# Altium project HV_offset_board.PrjPcb
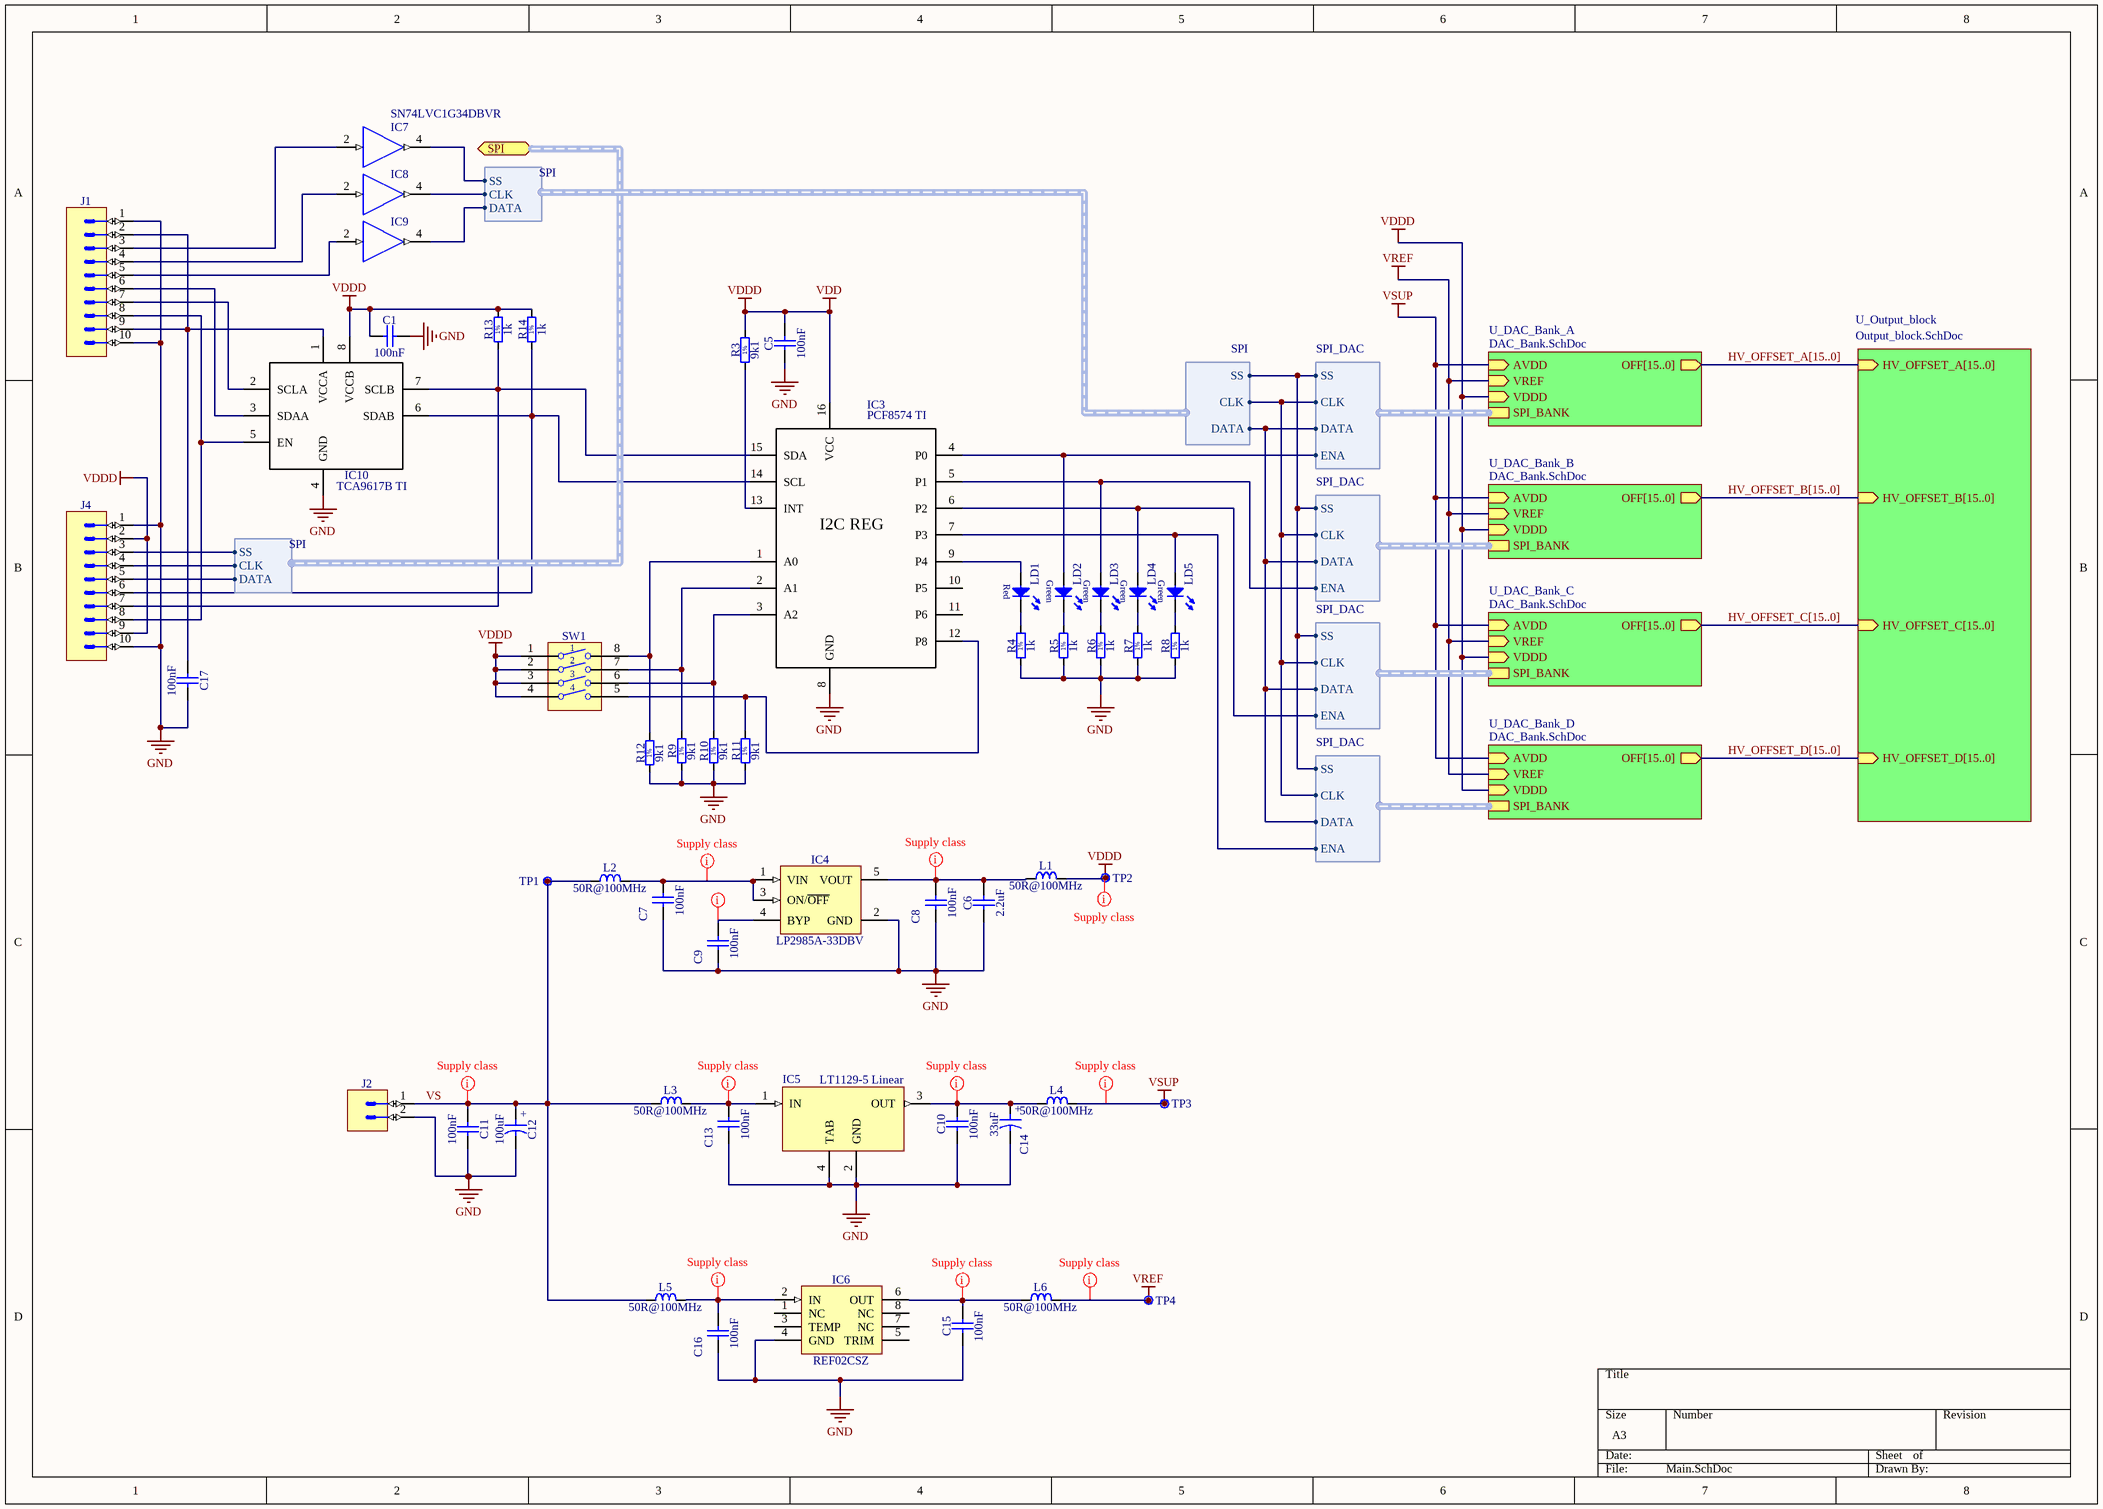
[diagram p0: Main.SchDoc]
4 sheets, 166 parts. Net scope: hierarchical (ports join the sheet entries above them; power ports are global).
Board file: PCB.PcbDoc
Sheets:
  Main.SchDoc
    U_DAC_Bank_A = DAC_Bank.SchDoc
      U_DAC = DAC.SchDoc
      U_DAC = DAC.SchDoc
      U_DAC = DAC.SchDoc
      U_DAC = DAC.SchDoc
    U_DAC_Bank_B = DAC_Bank.SchDoc
      U_DAC = DAC.SchDoc
      U_DAC = DAC.SchDoc
      U_DAC = DAC.SchDoc
      U_DAC = DAC.SchDoc
    U_DAC_Bank_C = DAC_Bank.SchDoc
      U_DAC = DAC.SchDoc
      U_DAC = DAC.SchDoc
      U_DAC = DAC.SchDoc
      U_DAC = DAC.SchDoc
    U_DAC_Bank_D = DAC_Bank.SchDoc
      U_DAC = DAC.SchDoc
      U_DAC = DAC.SchDoc
      U_DAC = DAC.SchDoc
      U_DAC = DAC.SchDoc
    U_Output_block = Output_block.SchDoc

## Sheet Main.SchDoc
size A3

### Parts
C1  100nF  [CAPC2012X135N]
C5  100nF  [CAPC2012X135N]
C6  2.2uF  [CAPC2012X135N]
C7  100nF  [CAPC2012X135N]
C8  100nF  [CAPC2012X135N]
C9  100nF  [CAPC2012X135N]
C10  100nF  [CAPC2012X135N]
C11  100nF  [CAPC2012X135N]
C12  100uF  [CAPAE660X540N]
C13  100nF  [CAPC2012X135N]
C14  33uF  [CAPAE660X540N]
C15  100nF  [CAPC2012X135N]
C16  100nF  [CAPC2012X135N]
C17  100nF  [CAPC2012X135N]
IC3  PCF8574 TI  [SOIC127P1030X265-16N]
IC4  LP2985A-33DBV  [SOT95P280X145-5N]
IC5  LT1129-5 Linear  [SOT230P700X175-4N]
IC6  REF02CSZ  [SOIC127P600X175-8N]
IC7  SN74LVC1G34DBVR  [SOT95P280X145-5N]
IC8  SN74LVC1G34DBVR  [SOT95P280X145-5N]  (value not drawn)
IC9  SN74LVC1G34DBVR  [SOT95P280X145-5N]  (value not drawn)
IC10  TCA9617B TI  [TSOP65P490X110-8N]
J1  Header 10  [3M_N2510-5002RB]  (value not drawn)
J2  (no value)  [CAMDEN_CTB9350/2A]
J4  Header 10  [3M_N2510-5002RB]  (value not drawn)
L1  50R@100MHz  [IND_MURATA_BLM31PG]
L2  50R@100MHz  [IND_MURATA_BLM31PG]
L3  50R@100MHz  [IND_MURATA_BLM31PG]
L4  50R@100MHz  [IND_MURATA_BLM31PG]
L5  50R@100MHz  [IND_MURATA_BLM31PG]
L6  50R@100MHz  [IND_MURATA_BLM31PG]
LD1  Super Red  [LED_OSRAM_LSR976]  (value not drawn)
LD2  Green  [LED_OSRAM_LGR971]  (value not drawn)
LD3  Green  [LED_OSRAM_LGR971]  (value not drawn)
LD4  Green  [LED_OSRAM_LGR971]  (value not drawn)
LD5  Green  [LED_OSRAM_LGR971]  (value not drawn)
R3  9k1  [RESC2012X60N]
R4  1k  [RESC2012X60N]
R5  1k  [RESC2012X60N]
R6  1k  [RESC2012X60N]
R7  1k  [RESC2012X60N]
R8  1k  [RESC2012X60N]
R9  9k1  [RESC2012X60N]
R10  9k1  [RESC2012X60N]
R11  9k1  [RESC2012X60N]
R12  9k1  [RESC2012X60N]
R13  1k  [RESC2012X60N]
R14  1k  [RESC2012X60N]
SW1  Switch  [SW_OMRON_A6S-4102-H]  (value not drawn)
TP1  Test Point  [VERO_20-2136]  (value not drawn)
TP2  Test Point  [VERO_20-2136]  (value not drawn)
TP3  Test Point  [VERO_20-2136]  (value not drawn)
TP4  Test Point  [VERO_20-2136]  (value not drawn)

### Sub-sheets
U_DAC_Bank_A = DAC_Bank.SchDoc: AVDD (in), VREF (in), VDDD (in), SPI_BANK (harness SPI_DAC), OFF[15..0] (out)
U_DAC_Bank_B = DAC_Bank.SchDoc: AVDD (in), VREF (in), VDDD (in), SPI_BANK (harness SPI_DAC), OFF[15..0] (out)
U_DAC_Bank_C = DAC_Bank.SchDoc: AVDD (in), VREF (in), VDDD (in), SPI_BANK (harness SPI_DAC), OFF[15..0] (out)
U_DAC_Bank_D = DAC_Bank.SchDoc: AVDD (in), VREF (in), VDDD (in), SPI_BANK (harness SPI_DAC), OFF[15..0] (out)
U_Output_block = Output_block.SchDoc: HV_OFFSET_A[15..0] (in), HV_OFFSET_D[15..0] (in), HV_OFFSET_C[15..0] (in), HV_OFFSET_B[15..0] (in)

### Ports
SPI (bidir, harness SPI)

### Harnesses
SPI_DAC: DATA, CLK, SS, ENA
SPI: DATA, CLK, SS

### Nets
GND: C1.2 C5.1 C6.1 C7.1 C8.1 C9.1 C10.1 C11.2 C12.2 C13.1 C14.2 C15.1 C16.1 C17.2 IC3.8(GND) IC4.2(GND) IC5.2(GND) IC5.4(TAB) IC6.4(GND) IC7.3(GND) IC8.3(GND) IC9.3(GND) IC10.4(GND) J1.1 J1.10 J2.2 J4.1 J4.10 R4.1 R5.1 R6.1 R7.1 R8.1 R9.1 R10.1 R11.1 R12.1
VDDD: C1.1 C5.2 IC3.16(VCC) IC7.5(VCC) IC8.5(VCC) IC9.5(VCC) IC10.8(VCCB) J4.2 J4.9 L1.2 R3.2 R13.2 R14.2 SW1.1 SW1.2 SW1.3 SW1.4 TP2.1 ; sheet U_DAC_Bank_A/VDDD, sheet U_DAC_Bank_B/VDDD, sheet U_DAC_Bank_C/VDDD, sheet U_DAC_Bank_D/VDDD  [also labelled VDD]
VREF: L6.2 TP4.1 ; sheet U_DAC_Bank_A/VREF, sheet U_DAC_Bank_B/VREF, sheet U_DAC_Bank_C/VREF, sheet U_DAC_Bank_D/VREF
VSUP: L4.2 TP3.1 ; sheet U_DAC_Bank_A/AVDD, sheet U_DAC_Bank_B/AVDD, sheet U_DAC_Bank_C/AVDD, sheet U_DAC_Bank_D/AVDD
VS: C11.1 C12.1 J2.1 L2.1 L3.1 L5.1 TP1.1
NetC6_2: C6.2 C8.2 IC4.5(VOUT) L1.1
NetC7_2: C7.2 IC4.1(VIN) IC4.3(ON/~{OFF}) L2.2
NetC9_2: C9.2 IC4.4(BYP)
NetC10_2: C10.2 C14.1 IC5.3(OUT) L4.1
NetC13_2: C13.2 IC5.1(IN) L3.2
NetC15_2: C15.2 IC6.6(OUT) L6.1
NetC16_2: C16.2 IC6.2(IN) L5.2
NetC17_1: C17.1 IC10.1(VCCA) J1.2 J1.9
NetIC2_U_DAC_Bank_A_U_DAC#1_9: IC7.4(OUT) J4.3 ; sheet U_DAC_Bank_A/SPI_BANK.SS, port SPI.SS, sheet U_DAC_Bank_B/SPI_BANK.SS, sheet U_DAC_Bank_C/SPI_BANK.SS, sheet U_DAC_Bank_D/SPI_BANK.SS
NetIC2_U_DAC_Bank_A_U_DAC#1_10: IC8.4(OUT) J4.4 ; sheet U_DAC_Bank_A/SPI_BANK.CLK, port SPI.CLK, sheet U_DAC_Bank_B/SPI_BANK.CLK, sheet U_DAC_Bank_C/SPI_BANK.CLK, sheet U_DAC_Bank_D/SPI_BANK.CLK
NetIC2_U_DAC_Bank_A_U_DAC#1_11: IC9.4(OUT) J4.5 ; sheet U_DAC_Bank_A/SPI_BANK.DATA, port SPI.DATA, sheet U_DAC_Bank_B/SPI_BANK.DATA, sheet U_DAC_Bank_C/SPI_BANK.DATA, sheet U_DAC_Bank_D/SPI_BANK.DATA
NetIC2_U_DAC_Bank_A_U_DAC#1_15: IC3.4(P0) LD2.2(A) ; sheet U_DAC_Bank_A/SPI_BANK.ENA
NetIC2_U_DAC_Bank_B_U_DAC#1_15: IC3.5(P1) LD3.2(A) ; sheet U_DAC_Bank_B/SPI_BANK.ENA
NetIC2_U_DAC_Bank_C_U_DAC#1_15: IC3.6(P2) LD4.2(A) ; sheet U_DAC_Bank_C/SPI_BANK.ENA
NetIC2_U_DAC_Bank_D_U_DAC#1_15: IC3.7(P3) LD5.2(A) ; sheet U_DAC_Bank_D/SPI_BANK.ENA
NetIC3_1: IC3.1(A0) R12.2 SW1.8
NetIC3_2: IC3.2(A1) R9.2 SW1.7
NetIC3_3: IC3.3(A2) R10.2 SW1.6
NetIC3_9: IC3.9(P4) LD1.2(A)
NetIC3_12: IC3.12(P8) R11.2 SW1.5
NetIC3_13: IC3.13(INT) R3.1
NetIC3_14: IC3.14(SCL) IC10.6(SDAB) J4.6 R14.1
NetIC3_15: IC3.15(SDA) IC10.7(SCLB) J4.7 R13.1
NetIC7_2: IC7.2(IN) J1.3
NetIC8_2: IC8.2(IN) J1.4
NetIC9_2: IC9.2(IN) J1.5
NetIC10_2: IC10.2(SCLA) J1.7
NetIC10_3: IC10.3(SDAA) J1.6
NetIC10_5: IC10.5(EN) J1.8 J4.8
NetLD1_1: LD1.1(C) R4.2
NetLD2_1: LD2.1(C) R5.2
NetLD3_1: LD3.1(C) R6.2
NetLD4_1: LD4.1(C) R7.2
NetLD5_1: LD5.1(C) R8.2

Not connected (* = marked no-connect by the designer): IC3 10(P5) 11(P6); IC6 1(NC) 3(TEMP) 5(TRIM) 7(NC) 8(NC)

### Buses and harness runs
bus HV_OFFSET_A[15..0] = sheet U_DAC_Bank_A/OFF[15..0] = sheet U_Output_block/HV_OFFSET_A[15..0]
bus HV_OFFSET_B[15..0] = sheet U_DAC_Bank_B/OFF[15..0] = sheet U_Output_block/HV_OFFSET_B[15..0]
bus HV_OFFSET_C[15..0] = sheet U_DAC_Bank_C/OFF[15..0] = sheet U_Output_block/HV_OFFSET_C[15..0]
bus HV_OFFSET_D[15..0] = sheet U_DAC_Bank_D/OFF[15..0] = sheet U_Output_block/HV_OFFSET_D[15..0]

### Layout directives
net class Supply: NetC6_2, NetC7_2, NetC9_2, NetC10_2, NetC13_2, NetC15_2, NetC16_2, VDDD, VREF, VS, VSUP

### Notes on the sheet
- (in symbol CAE660-540_33UF_25V_20%) +
- (in symbol CAE660-540_100UF_16V_20%) +
- (in symbol LED_OSRAM_LSR976) Red
- (in symbol PCF8574) I2C REG
- (in symbol R0805_1K_1%_0.125W_100PPM) 1%
- (in symbol R0805_9K1_1%_0.125W_100PPM) 1%

### Library data of the parts
C1 C5 C7-C11 C13 C15-C17 = CC0805_100NF_50V_10%_X7R: Non-polarised capacitor; Part Description: SMD Multilayer Chip Ceramic Capacitor; Manufacturer: GENERIC; Manufacturer1 Part Number: C2012X7R1H104K085AA; Voltage: 50V; TC: X7R; Tolerance: ±10%; Part Number: CC0805_100NF_50V_10%_X7R; Component Kind: Standard; Component Type: Standard; Pin Count: 2; Value: 100nF; Status: Preferred; Manufacturer Part Number: CC0805_100NF_50V_10%_X7R; Case: 0805; Mounted: Yes; Socket: No; SMD: Yes; Sense: No; Manufacturer1 Example: TDK; Manufacturer1 ComponentHeight: 1mm; HelpURL: \\cern.ch\dfs\Applications\Altium\Datasheets\CC0805_X7R_TDK_C.pdf; Author: CERN DEM JLC; CreateDate: 03.12.2007; LatestRevisionDate: 22.04.2015
C6 = CC0805_2.2UF_16V_10%_X7R: Non-polarised capacitor; Part Description: SMD Multilayer Chip Ceramic Capacitor; Manufacturer: GENERIC; Manufacturer1 Part Number: GRM21BF51C225ZA01L; Voltage: 16V; TC: X7R; Tolerance: ±10%; Part Number: CC0805_2.2UF_16V_10%_X7R; Component Kind: Standard; Component Type: Standard; Pin Count: 2; Value: 2.2uF; Status: Preferred; Manufacturer Part Number: CC0805_2.2UF_16V_10%_X7R; Case: 0805; Mounted: Yes; Socket: No; SMD: Yes; Sense: No; Manufacturer1 Example: MURATA; Manufacturer1 ComponentHeight: 1.5mm; HelpURL: \\cern.ch\dfs\Applications\Altium\Datasheets\CC0805_X7R_MURATA_GRM.pdf; Author: CERN DEM JLC; CreateDate: 03.12.2007; LatestRevisionDate: 18.09.2014
C12 = CAE660-540_100UF_16V_20%: Polarised capacitor; Part Description: Aluminum Electrolytic SMT Capacitor; Manufacturer: PANASONIC; Manufacturer Part Number: EEEFK1C101AP; Voltage: 16V; Tolerance: ±20%; Part Number: CAE660-540_100UF_16V_20%; Component Kind: Standard; Component Type: Standard; Pin Count: 2; Value: 100uF; Status: Not Recommended; Case: D; Mounted: Yes; Socket: No; SMD: Yes; Sense: No; ComponentHeight: 5.8mm; HelpURL: \\cern.ch\dfs\Applications\Altium\Datasheets\CAE_PANASONIC_FK.pdf; Author: CERN DEM JLC; CreateDate: 03.12.2007; LatestRevisionDate: 05.11.2014
C14 = CAE660-540_33UF_25V_20%: Polarised capacitor; Part Description: Aluminum Electrolytic SMT Capacitor; Manufacturer: PANASONIC; Manufacturer Part Number: EEEFK1E330AP; Voltage: 25V; Tolerance: ±20%; Part Number: CAE660-540_33UF_25V_20%; Component Kind: Standard; Component Type: Standard; Pin Count: 2; Value: 33uF; Status: Not Recommended; Case: D; Mounted: Yes; Socket: No; SMD: Yes; Sense: No; ComponentHeight: 5.8mm; HelpURL: \\cern.ch\dfs\Applications\Altium\Datasheets\CAE_PANASONIC_FK.pdf; Author: CERN DEM JLC; CreateDate: 03.12.2007; LatestRevisionDate: 05.11.2014
IC3 = PCF8574: Name: PCF8574; Manufacturer: TI
IC4 = LP2985A-33DBV: 150mA Low-Noise Low-Dropout Regulator Whit Shutdown; Part Description: 3.3V, 150mA Low-Noise Low-Dropout Regulator Whit Shutdown; Manufacturer: TEXAS INSTRUMENTS; PressFit: No; Bonding: No; Part Number: LP2985A-33DBV; Component Kind: Standard; Component Type: Standard; Device: LP2985A-33DBV; PackageDescription: SOT, 0.95mm pitch; 5 pin, 1.60mm W X 2.90mm L X 1.45mm H body, IPC Medium Density; Manufacturer Part Number: LP2985A-33DBV; Pin Count: 5; Case: SOT23-5; Mounted: Yes; Socket: No; SMD: Yes; Sense: No; ComponentHeight: 1.45mm; HelpURL: \\cern.ch\dfs\Applications\Altium\Datasheets\LP2985A-33DBV.pdf; Author: CERN DEM JLC; CreateDate: 17.03.2011; LatestRevisionDate: 17.03.2011
IC5 = LT1129-5: Name: LT1129-5; Manufacturer: Linear
IC6 = REF02CSZ: Precision Voltage Reference/Temperature Transducer; Part Description: 5V Precision Voltage Reference/Temperature Transducer; Manufacturer: ANALOG DEVICES; PressFit: No; Bonding: No; Part Number: REF02CSZ; Component Kind: Standard; Component Type: Standard; Device: REF02CSZ; PackageDescription: SOIC 8, Pitch 1.27mm, Body 4x5mm, IPC Medium Density; Manufacturer Part Number: REF02CSZ; Pin Count: 8; Case: SOIC8; Mounted: Yes; Socket: No; SMD: Yes; Sense: No; ComponentHeight: 1.75mm; HelpURL: \\cern.ch\dfs\Applications\Altium\Datasheets\REF02CSZ.pdf; Author: CERN DEM JLC; CreateDate: 29.05.2008; LatestRevisionDate: 29.05.2008
IC7-IC9 = SN74LVC1G34DBVR: Single Buffer Gate; Manufacturer: TEXAS INSTRUMENTS; PressFit: No; Bonding: No; Part Number: SN74LVC1G34DBVR; Component Kind: Standard; Component Type: Standard; Device: SN74LVC1G34DBVR; PackageDescription: SOT, 0.95mm pitch; 5 pin, 1.60mm W X 2.90mm L X 1.45mm H body, IPC Medium Density; Part Description: Single Buffer Gate; Manufacturer Part Number: SN74LVC1G34DBVR; Pin Count: 5; Case: SOT23-5; Mounted: Yes; Socket: No; SMD: Yes; Sense: No; ComponentHeight: 1.45mm; Author: CERN DEM JLC; HelpURL: \\cern.ch\dfs\Applications\Altium\Datasheets\SN74LVC1G34DBVR.pdf; CreateDate: 20.01.2014; LatestRevisionDate: 20.01.2014
IC10 = TCA9617B: Name: TCA9617B; Manufacturer: TI
J1 J4 = 3M_N2510-5002RB: Connector 10 Male; Part Description: 10 Contacts - Right Angle .100" x .100" Low Profile Four-Wall Header, 2500 Series; Manufacturer: 3M; PressFit: No; Part Number: 3M_N2510-5002RB; Component Kind: Standard; Component Type: Standard; Pin Count: 10; Family: Header 10; Mounted: Yes; Socket: No; SMD: No; Sense: No; Status: None; Manufacturer Part Number: N2510-5002RB; ComponentHeight: 8.59mm; HelpURL: \\cern.ch\dfs\Applications\Altium\Datasheets\3M_N2510-5002RB.pdf; Author: CERN DEM JLC; CreateDate: 29.10.2008; LatestRevisionDate: 11.08.2009
J2 = CAMDEN_CTB9350/2A: Connector 2 Male; Part Description: 12A 380V, Pitch: 5mm, 2 Positions, Horizontal  Male Terminal Block; Manufacturer: CAMDEN; PressFit: No; Part Number: CAMDEN_CTB9350/2A; Component Kind: Standard; Component Type: Standard; Pin Count: 2; Mounted: Yes; Socket: No; SMD: No; Sense: No; Status: None; Manufacturer Part Number: CTB9350/2A; ComponentHeight: 8.3mm; HelpURL: \\cern.ch\dfs\Applications\Altium\Datasheets\CAMDEN_CTB9350-2A.pdf; Author: CERN DEM JLC; CreateDate: 28.09.2011; LatestRevisionDate: 28.09.2011
L1-L6 = IND1206_MURATA_BLM31PG500SN1: Inductor; Part Description: SMD EMIFIL Chip Ferrite Bead; Manufacturer: MURATA; Power: 3.5A; Resistance: 0.015R; Part Number: IND1206_MURATA_BLM31PG500SN1; Component Kind: Standard; Component Type: Standard; Pin Count: 2; Value: 50R@100MHz; Status: None; Manufacturer Part Number: BLM31PG500SN1; Case: 1206; Mounted: Yes; Socket: No; SMD: Yes; Sense: No; ComponentHeight: 1.3mm; HelpURL: \\cern.ch\dfs\Applications\Altium\Datasheets\IND1206_MURATA_BLM31P.pdf; Author: CERN DEM JLC; CreateDate: 05.12.2013; LatestRevisionDate: 05.12.2013
LD1 = LED_OSRAM_LSR976: LED Red 1C 2A; Part Description: Surface Mount Super Red LED (0805 Case); Manufacturer: OSRAM; Manufacturer Part Number: LSR976; PressFit: No; Bonding: No; Part Number: LED_OSRAM_LSR976; Component Kind: Standard; Component Type: Standard; Color: Super Red; PackageDescription: Super Red Chip LED, 2-Leads, Body 2 x1.25mm, IPC Medium Density; Pin Count: 2; Case: 0805; Mounted: Yes; Socket: No; SMD: Yes; Sense: No; ComponentHeight: 0.9mm; HelpURL: \\cern.ch\dfs\Applications\Altium\Datasheets\LED_OSRAM_LSR976.pdf; Author: CERN DEM JLC; CreateDate: 18.05.2010; LatestRevisionDate: 18.05.2010
LD2-LD5 = LED_OSRAM_LGR971: LED Green 1C 2A; Part Description: Surface Mount Green LED (0805 Case); Manufacturer: OSRAM; Manufacturer Part Number: LGR971; PressFit: No; Bonding: No; Part Number: LED_OSRAM_LGR971; Component Kind: Standard; Component Type: Standard; Color: Green; PackageDescription: Green Chip LED, 2-Leads, Body 2.0x1.25mm, IPC Medium Density; Pin Count: 2; Case: 0805; Mounted: Yes; Socket: No; SMD: Yes; Sense: No; ComponentHeight: 0.9mm; HelpURL: \\cern.ch\dfs\Applications\Altium\Datasheets\LED_OSRAM_LGR971.pdf; Author: CERN DEM JLC; CreateDate: 28.01.2009; LatestRevisionDate: 17.03.2010
R3 R9-R12 = R0805_9K1_1%_0.125W_100PPM: Resistor - 1%; Part Description: General Purpose Thick Film Chip Resistor; Manufacturer: GENERIC; Manufacturer1 Part Number: NRC10F9101TRF; Power: 0.125W; TC: ±100ppm/°C; PressFit: No; Part Number: R0805_9K1_1%_0.125W_100PPM; Component Kind: Standard; Component Type: Standard; Pin Count: 2; Value: 9k1; Status: Preferred; Tolerance: ±1%; Manufacturer Part Number: R0805_9K1_1%_0.125W_100PPM; Case: 0805; Mounted: Yes; Sense: No; Socket: No; SMD: Yes; Manufacturer1 Example: NIC COMPONENT; Manufacturer1 ComponentHeight: 0.6mm; HelpURL: \\cern.ch\dfs\Applications\Altium\Datasheets\R0805_NIC_NRC.pdf; Author: CERN DEM JLC; CreateDate: 03.12.2007; LatestRevisionDate: 13.03.2008
R4-R8 R13 R14 = R0805_1K_1%_0.125W_100PPM: Resistor - 1%; Part Description: General Purpose Thick Film Chip Resistor; Manufacturer: GENERIC; Manufacturer1 Part Number: NRC10F1001TRF; Power: 0.125W; TC: ±100ppm/°C; PressFit: No; Part Number: R0805_1K_1%_0.125W_100PPM; Component Kind: Standard; Component Type: Standard; Pin Count: 2; Value: 1k; Status: Preferred; Tolerance: ±1%; Manufacturer Part Number: R0805_1K_1%_0.125W_100PPM; Case: 0805; Mounted: Yes; Sense: No; Socket: No; SMD: Yes; Manufacturer1 Example: NIC COMPONENT; Manufacturer1 ComponentHeight: 0.6mm; HelpURL: \\cern.ch\dfs\Applications\Altium\Datasheets\R0805_NIC_NRC.pdf; Author: CERN DEM JLC; CreateDate: 03.12.2007; LatestRevisionDate: 13.03.2008
SW1 = SW_OMRON_A6S-4102-H: 4 Ways SPST DIP Switch; Part Description: 4 Ways SPST DIP Switch, White Flat Actuator with Seal Tape, Contact Rating 25mA 24VDC; Manufacturer: OMRON; PressFit: No; Part Number: SW_OMRON_A6S-4102-H; Component Kind: Standard; Component Type: Standard; Pin Count: 8; PackageDescription: Pitch 2.54mm, Body 11.3x6.4mm, 4 Ways SPST Surface-Mounting DIP Switch, OMRON A6S-H; Family: Switch; Mounted: Yes; Socket: No; SMD: Yes; Sense: No; Status: None; Manufacturer Part Number: A6S-4102-H; ComponentHeight: 3.8mm; HelpURL: \\cern.ch\dfs\Applications\Altium\Datasheets\SW_OMRON_A6S-4102-H.pdf; Author: CERN DEM JMW; CreateDate: 25.09.2008; LatestRevisionDate: 25.09.2008
TP1-TP4 = VERO_20-2136: Part Description: Black Bead PCB Terminal Test Pin for 1.6mm PCB Thickness (1.32mm Hole); Manufacturer: VERO TECHNOLOGIES; PressFit: No; Part Number: VERO_20-2136; Component Kind: Standard; Component Type: Standard; Pin Count: 1; Family: Test Point; Mounted: Yes; Socket: No; SMD: No; Sense: No; Status: None; Manufacturer Part Number: 20-2136; ComponentHeight: 5.3mm; HelpURL: \\cern.ch\dfs\Applications\Altium\Datasheets\VERO_20-2136.pdf; Author: CERN DEM JLC; CreateDate: 21.07.2008; LatestRevisionDate: 15.07.2013

## Sheet DAC_Bank.SchDoc
size A4
Used 4 times, as channels U_DAC_Bank_A, U_DAC_Bank_B, U_DAC_Bank_C, U_DAC_Bank_D. Parts and nets are listed once, with the designators drawn on the sheet.
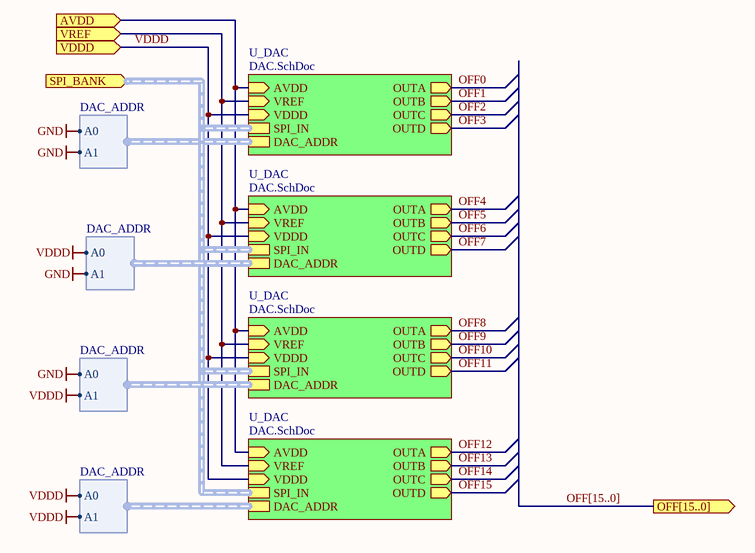
[diagram p1: DAC_Bank.SchDoc]

### Sub-sheets
U_DAC = DAC.SchDoc: AVDD (in), VREF (in), VDDD (in), SPI_IN (harness SPI_DAC), DAC_ADDR (harness DAC_ADDR), OUTA (out), OUTB (out), OUTC (out), OUTD (out)
U_DAC = DAC.SchDoc: AVDD (in), VREF (in), VDDD (in), SPI_IN (harness SPI_DAC), DAC_ADDR (harness DAC_ADDR), OUTA (out), OUTB (out), OUTC (out), OUTD (out)
U_DAC = DAC.SchDoc: AVDD (in), VREF (in), VDDD (in), SPI_IN (harness SPI_DAC), DAC_ADDR (harness DAC_ADDR), OUTA (out), OUTB (out), OUTC (out), OUTD (out)
U_DAC = DAC.SchDoc: AVDD (in), VREF (in), VDDD (in), SPI_IN (harness SPI_DAC), DAC_ADDR (harness DAC_ADDR), OUTA (out), OUTB (out), OUTC (out), OUTD (out)

### Ports
AVDD (in), OFF[15..0] (out), SPI_BANK (in, harness SPI_DAC), VDDD (in), VREF (in)

### Harnesses
DAC_ADDR: A0, A1

### Nets
GND: sheet U_DAC/DAC_ADDR.A0, sheet U_DAC/DAC_ADDR.A1
VDDD: port VDDD, sheet U_DAC/VDDD, sheet U_DAC/VDDD, sheet U_DAC/VDDD, sheet U_DAC/VDDD, sheet U_DAC/DAC_ADDR.A0, sheet U_DAC/DAC_ADDR.A1
AVDD: port AVDD, sheet U_DAC/AVDD, sheet U_DAC/AVDD, sheet U_DAC/AVDD, sheet U_DAC/AVDD
VREF: port VREF, sheet U_DAC/VREF, sheet U_DAC/VREF, sheet U_DAC/VREF, sheet U_DAC/VREF

### Channels
U_DAC_Bank_A: ports AVDD=VSUP VDDD=VDDD VREF=VREF
U_DAC_Bank_B: ports AVDD=VSUP VDDD=VDDD VREF=VREF
U_DAC_Bank_C: ports AVDD=VSUP VDDD=VDDD VREF=VREF
U_DAC_Bank_D: ports AVDD=VSUP VDDD=VDDD VREF=VREF

### Buses and harness runs
bus OFF[15..0] = port OFF[15..0]
harness port SPI_BANK = sheet U_DAC/SPI_IN

## Sheet DAC.SchDoc
size A4
Used 16 times, as channels U_DAC_Bank_A/U_DAC, U_DAC_Bank_A/U_DAC, U_DAC_Bank_A/U_DAC, U_DAC_Bank_A/U_DAC, U_DAC_Bank_B/U_DAC, U_DAC_Bank_B/U_DAC, U_DAC_Bank_B/U_DAC, U_DAC_Bank_B/U_DAC, U_DAC_Bank_C/U_DAC, U_DAC_Bank_C/U_DAC, U_DAC_Bank_C/U_DAC, U_DAC_Bank_C/U_DAC, U_DAC_Bank_D/U_DAC, U_DAC_Bank_D/U_DAC, U_DAC_Bank_D/U_DAC, U_DAC_Bank_D/U_DAC. Parts and nets are listed once, with the designators drawn on the sheet.
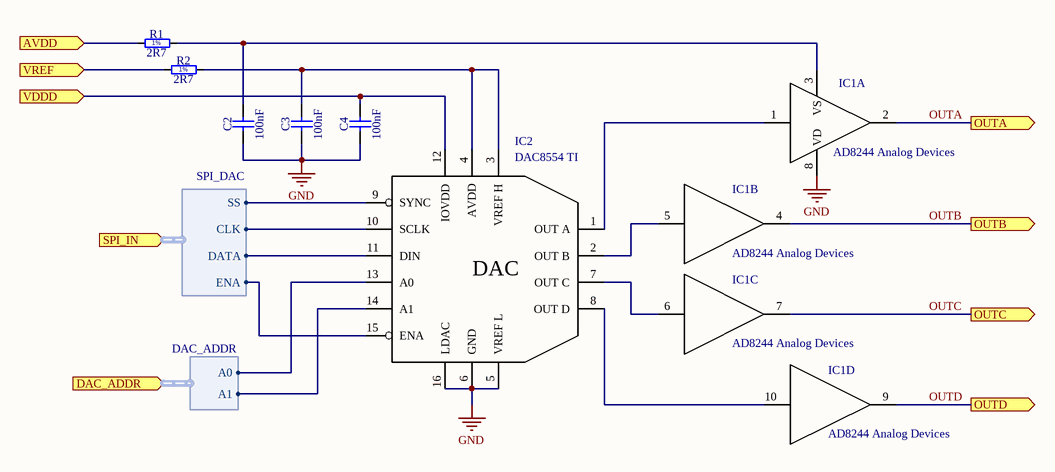
[diagram p2: DAC.SchDoc]

### Parts
C2  100nF  [CAPC2012X135N]
C3  100nF  [CAPC2012X135N]
C4  100nF  [CAPC2012X135N]
IC1  AD8244 Analog Devices  [TSSOP50P490X110-10N]  (parts A,B,C,D of 4)
IC2  DAC8554 TI  [TSOP65P640X120-16N]
R1  2R7  [RESC2012X60N]
R2  2R7  [RESC2012X60N]

### Ports
AVDD (in), DAC_ADDR (in, harness DAC_ADDR), OUTA (out), OUTB (out), OUTC (out), OUTD (out), SPI_IN (in, harness SPI_DAC), VDDD (in), VREF (in)

### Harnesses
SPI_DAC: DATA, CLK, SS, ENA
DAC_ADDR: A0, A1

### Nets
GND: C2.1 C3.1 C4.1 IC1.8(VD) IC2.5(VREF_L) IC2.6(GND) IC2.16(LDAC)
AVDD: R1.1 ; port AVDD
OUTA: IC1.2(OUT_A) ; port OUTA
OUTB: IC1.4(OUT_B) ; port OUTB
OUTC: IC1.7(OUT_C) ; port OUTC
OUTD: IC1.9(OUT_D) ; port OUTD
VDDD: C4.2 IC2.12(IOVDD) ; port VDDD
VREF: R2.1 ; port VREF
NetC2_2: C2.2 IC1.3(VS) R1.2
NetC3_2: C3.2 IC2.3(VREF_H) IC2.4(AVDD) R2.2
NetIC1_1: IC1.1(IN_A) IC2.1(OUT_A)
NetIC1_5: IC1.5(IN_B) IC2.2(OUT_B)
NetIC1_6: IC1.6(IN_C) IC2.7(OUT_C)
NetIC1_10: IC1.10(IN_D) IC2.8(OUT_D)
NetIC2_9: IC2.9(SYNC) ; port SPI_IN.SS
NetIC2_10: IC2.10(SCLK) ; port SPI_IN.CLK
NetIC2_11: IC2.11(DIN) ; port SPI_IN.DATA
NetIC2_13: IC2.13(A0) ; port DAC_ADDR.A0
NetIC2_14: IC2.14(A1) ; port DAC_ADDR.A1
NetIC2_15: IC2.15(ENA) ; port SPI_IN.ENA

### Channels
U_DAC_Bank_A/U_DAC: designators end in _U_DAC_Bank_A_U_DAC#1; ports AVDD=VSUP OUTA=HV_OFFSET_A0 OUTB=HV_OFFSET_A1 OUTC=HV_OFFSET_A2 OUTD=HV_OFFSET_A3 VDDD=VDDD VREF=VREF
U_DAC_Bank_A/U_DAC: designators end in _U_DAC_Bank_A_U_DAC#2; ports AVDD=VSUP OUTA=HV_OFFSET_A4 OUTB=HV_OFFSET_A5 OUTC=HV_OFFSET_A6 OUTD=HV_OFFSET_A7 VDDD=VDDD VREF=VREF
U_DAC_Bank_A/U_DAC: designators end in _U_DAC_Bank_A_U_DAC#3; ports AVDD=VSUP OUTA=HV_OFFSET_A8 OUTB=HV_OFFSET_A9 OUTC=HV_OFFSET_A10 OUTD=HV_OFFSET_A11 VDDD=VDDD VREF=VREF
U_DAC_Bank_A/U_DAC: designators end in _U_DAC_Bank_A_U_DAC#4; ports AVDD=VSUP OUTA=HV_OFFSET_A12 OUTB=HV_OFFSET_A13 OUTC=HV_OFFSET_A14 OUTD=HV_OFFSET_A15 VDDD=VDDD VREF=VREF
U_DAC_Bank_B/U_DAC: designators end in _U_DAC_Bank_B_U_DAC#1; ports AVDD=VSUP OUTA=HV_OFFSET_B0 OUTB=HV_OFFSET_B1 OUTC=HV_OFFSET_B2 OUTD=HV_OFFSET_B3 VDDD=VDDD VREF=VREF
U_DAC_Bank_B/U_DAC: designators end in _U_DAC_Bank_B_U_DAC#2; ports AVDD=VSUP OUTA=HV_OFFSET_B4 OUTB=HV_OFFSET_B5 OUTC=HV_OFFSET_B6 OUTD=HV_OFFSET_B7 VDDD=VDDD VREF=VREF
U_DAC_Bank_B/U_DAC: designators end in _U_DAC_Bank_B_U_DAC#3; ports AVDD=VSUP OUTA=HV_OFFSET_B8 OUTB=HV_OFFSET_B9 OUTC=HV_OFFSET_B10 OUTD=HV_OFFSET_B11 VDDD=VDDD VREF=VREF
U_DAC_Bank_B/U_DAC: designators end in _U_DAC_Bank_B_U_DAC#4; ports AVDD=VSUP OUTA=HV_OFFSET_B12 OUTB=HV_OFFSET_B13 OUTC=HV_OFFSET_B14 OUTD=HV_OFFSET_B15 VDDD=VDDD VREF=VREF
U_DAC_Bank_C/U_DAC: designators end in _U_DAC_Bank_C_U_DAC#1; ports AVDD=VSUP OUTA=HV_OFFSET_C0 OUTB=HV_OFFSET_C1 OUTC=HV_OFFSET_C2 OUTD=HV_OFFSET_C3 VDDD=VDDD VREF=VREF
U_DAC_Bank_C/U_DAC: designators end in _U_DAC_Bank_C_U_DAC#2; ports AVDD=VSUP OUTA=HV_OFFSET_C4 OUTB=HV_OFFSET_C5 OUTC=HV_OFFSET_C6 OUTD=HV_OFFSET_C7 VDDD=VDDD VREF=VREF
U_DAC_Bank_C/U_DAC: designators end in _U_DAC_Bank_C_U_DAC#3; ports AVDD=VSUP OUTA=HV_OFFSET_C8 OUTB=HV_OFFSET_C9 OUTC=HV_OFFSET_C10 OUTD=HV_OFFSET_C11 VDDD=VDDD VREF=VREF
U_DAC_Bank_C/U_DAC: designators end in _U_DAC_Bank_C_U_DAC#4; ports AVDD=VSUP OUTA=HV_OFFSET_C12 OUTB=HV_OFFSET_C13 OUTC=HV_OFFSET_C14 OUTD=HV_OFFSET_C15 VDDD=VDDD VREF=VREF
U_DAC_Bank_D/U_DAC: designators end in _U_DAC_Bank_D_U_DAC#1; ports AVDD=VSUP OUTA=HV_OFFSET_D0 OUTB=HV_OFFSET_D1 OUTC=HV_OFFSET_D2 OUTD=HV_OFFSET_D3 VDDD=VDDD VREF=VREF
U_DAC_Bank_D/U_DAC: designators end in _U_DAC_Bank_D_U_DAC#2; ports AVDD=VSUP OUTA=HV_OFFSET_D4 OUTB=HV_OFFSET_D5 OUTC=HV_OFFSET_D6 OUTD=HV_OFFSET_D7 VDDD=VDDD VREF=VREF
U_DAC_Bank_D/U_DAC: designators end in _U_DAC_Bank_D_U_DAC#3; ports AVDD=VSUP OUTA=HV_OFFSET_D8 OUTB=HV_OFFSET_D9 OUTC=HV_OFFSET_D10 OUTD=HV_OFFSET_D11 VDDD=VDDD VREF=VREF
U_DAC_Bank_D/U_DAC: designators end in _U_DAC_Bank_D_U_DAC#4; ports AVDD=VSUP OUTA=HV_OFFSET_D12 OUTB=HV_OFFSET_D13 OUTC=HV_OFFSET_D14 OUTD=HV_OFFSET_D15 VDDD=VDDD VREF=VREF

### Notes on the sheet
- (in symbol DAC8554) DAC
- (in symbol R0805_2R7_1%_0.125W_200PPM) 1%

### Library data of the parts
C2-C4 = CC0805_100NF_50V_10%_X7R: as C1 on sheet Main; Part Number: CC0805_100NF_50V_10%_X7R; Component Kind: Standard; Component Type: Standard; Pin Count: 2; Value: 100nF; Status: Preferred; Manufacturer Part Number: CC0805_100NF_50V_10%_X7R; Case: 0805; Mounted: Yes; Socket: No; SMD: Yes; Sense: No; Manufacturer1 Example: TDK; Manufacturer1 ComponentHeight: 1mm; HelpURL: \\cern.ch\dfs\Applications\Altium\Datasheets\CC0805_X7R_TDK_C.pdf; Author: CERN DEM JLC; CreateDate: 03.12.2007; LatestRevisionDate: 22.04.2015
IC1 = AD8244: Name: AD8244; Manufacturer: Analog Devices
IC2 = DAC8554: Name: DAC8554; Manufacturer: TI
R1 R2 = R0805_2R7_1%_0.125W_200PPM: Resistor - 1%; Part Description: General Purpose Thick Film Chip Resistor; Manufacturer: GENERIC; Manufacturer1 Part Number: 232273462708L or RC0805FR-072R7L; Power: 0.125W; TC: ±200ppm/°C; PressFit: No; Part Number: R0805_2R7_1%_0.125W_200PPM; Component Kind: Standard; Component Type: Standard; Pin Count: 2; Value: 2R7; Status: Preferred; Tolerance: ±1%; Manufacturer Part Number: R0805_2R7_1%_0.125W_200PPM; Case: 0805; Mounted: Yes; Sense: No; Socket: No; SMD: Yes; Manufacturer1 Example: YAGEO PHYCOMP; Manufacturer1 ComponentHeight: 0.65mm; HelpURL: \\cern.ch\dfs\Applications\Altium\Datasheets\R0805_Phycomp_RC0805.pdf; Author: CERN DEM JLC; CreateDate: 03.12.2007; LatestRevisionDate: 17.10.2012

## Sheet Output_block.SchDoc
size A4
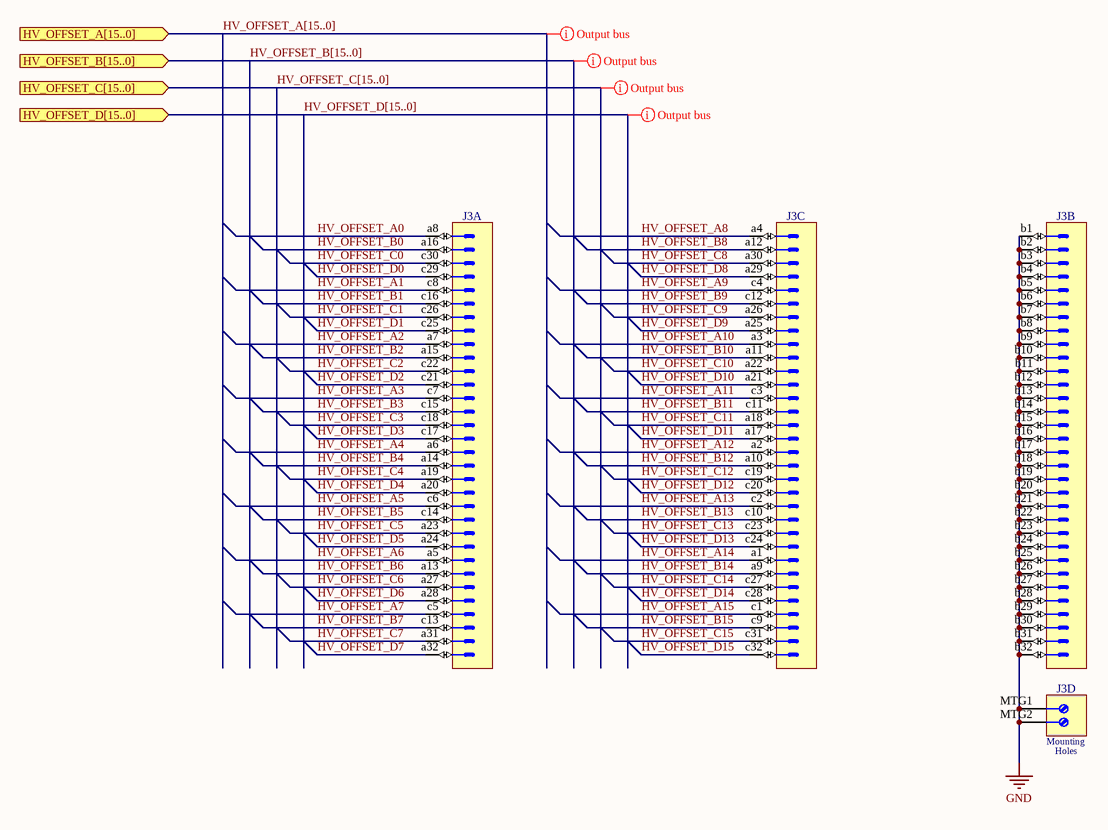
[diagram p3: Output_block.SchDoc]

### Parts
J3  DIN 41612 Type C  [HARTING_09 03 696 6921]  (value not drawn)  (parts A,B,C,D of 4)

### Ports
HV_OFFSET_A[15..0] (in), HV_OFFSET_B[15..0] (in), HV_OFFSET_C[15..0] (in), HV_OFFSET_D[15..0] (in)

### Nets
GND: J3.b1 J3.b2 J3.b3 J3.b4 J3.b5 J3.b6 J3.b7 J3.b8 J3.b9 J3.b10 J3.b11 J3.b12 J3.b13 J3.b14 J3.b15 J3.b16 J3.b17 J3.b18 J3.b19 J3.b20 J3.b21 J3.b22 J3.b23 J3.b24 J3.b25 J3.b26 J3.b27 J3.b28 J3.b29 J3.b30 J3.b31 J3.b32 J3.MTG1 J3.MTG2
HV_OFFSET_A0: J3.a8
HV_OFFSET_A1: J3.c8
HV_OFFSET_A2: J3.a7
HV_OFFSET_A3: J3.c7
HV_OFFSET_A4: J3.a6
HV_OFFSET_A5: J3.c6
HV_OFFSET_A6: J3.a5
HV_OFFSET_A7: J3.c5
HV_OFFSET_A8: J3.a4
HV_OFFSET_A9: J3.c4
HV_OFFSET_A10: J3.a3
HV_OFFSET_A11: J3.c3
HV_OFFSET_A12: J3.a2
HV_OFFSET_A13: J3.c2
HV_OFFSET_A14: J3.a1
HV_OFFSET_A15: J3.c1
HV_OFFSET_B0: J3.a16
HV_OFFSET_B1: J3.c16
HV_OFFSET_B2: J3.a15
HV_OFFSET_B3: J3.c15
HV_OFFSET_B4: J3.a14
HV_OFFSET_B5: J3.c14
HV_OFFSET_B6: J3.a13
HV_OFFSET_B7: J3.c13
HV_OFFSET_B8: J3.a12
HV_OFFSET_B9: J3.c12
HV_OFFSET_B10: J3.a11
HV_OFFSET_B11: J3.c11
HV_OFFSET_B12: J3.a10
HV_OFFSET_B13: J3.c10
HV_OFFSET_B14: J3.a9
HV_OFFSET_B15: J3.c9
HV_OFFSET_C0: J3.c30
HV_OFFSET_C1: J3.c26
HV_OFFSET_C2: J3.c22
HV_OFFSET_C3: J3.c18
HV_OFFSET_C4: J3.a19
HV_OFFSET_C5: J3.a23
HV_OFFSET_C6: J3.a27
HV_OFFSET_C7: J3.a31
HV_OFFSET_C8: J3.a30
HV_OFFSET_C9: J3.a26
HV_OFFSET_C10: J3.a22
HV_OFFSET_C11: J3.a18
HV_OFFSET_C12: J3.c19
HV_OFFSET_C13: J3.c23
HV_OFFSET_C14: J3.c27
HV_OFFSET_C15: J3.c31
HV_OFFSET_D0: J3.c29
HV_OFFSET_D1: J3.c25
HV_OFFSET_D2: J3.c21
HV_OFFSET_D3: J3.c17
HV_OFFSET_D4: J3.a20
HV_OFFSET_D5: J3.a24
HV_OFFSET_D6: J3.a28
HV_OFFSET_D7: J3.a32
HV_OFFSET_D8: J3.a29
HV_OFFSET_D9: J3.a25
HV_OFFSET_D10: J3.a21
HV_OFFSET_D11: J3.a17
HV_OFFSET_D12: J3.c20
HV_OFFSET_D13: J3.c24
HV_OFFSET_D14: J3.c28
HV_OFFSET_D15: J3.c32

### Buses and harness runs
bus HV_OFFSET_A[15..0] = port HV_OFFSET_A[15..0]
bus HV_OFFSET_B[15..0] = port HV_OFFSET_B[15..0]
bus HV_OFFSET_C[15..0] = port HV_OFFSET_C[15..0]
bus HV_OFFSET_D[15..0] = port HV_OFFSET_D[15..0]

### Layout directives
mark named Output bus: (no net found under the mark)

### Notes on the sheet
- (in symbol HARTING_09 03 696 6921, part D) Mounting; Holes

### Library data of the parts
J3 = HARTING_09 03 696 6921: Connector 96abc male (3x32); Part Description: DIN 41612, Type C, Thru-Hole;  Rows a+b+c, 96 Position, Performance level 2, Lead 3.0 mm, Pitch 2.54mm, Right Angle Male Connector With Coding; PressFit: No; Part Number: HARTING_09 03 696 6921; Component Kind: Standard; Component Type: Standard; Pin Count: 98; Family: DIN 41612 Type C; Mounted: Yes; Socket: No; SMD: No; Sense: No; Status: None; Manufacturer: HARTING; Manufacturer Part Number: 09 03 696 6921; ComponentHeight: 13.1mm; HelpURL: \\cern.ch\dfs\Applications\Altium\Datasheets\HARTING_09 03 696 6921.pdf; Author: CERN DEM JLC; CreateDate: 30.03.2011; LatestRevisionDate: 30.03.2011

## Nets that join several sheets
GND: Main (37 pins), U_DAC_Bank_A/U_DAC (9 pins), U_DAC_Bank_A/U_DAC (8 pins), U_DAC_Bank_A/U_DAC (8 pins), U_DAC_Bank_A/U_DAC (7 pins), U_DAC_Bank_B/U_DAC (9 pins), U_DAC_Bank_B/U_DAC (8 pins), U_DAC_Bank_B/U_DAC (8 pins), U_DAC_Bank_B/U_DAC (7 pins), U_DAC_Bank_C/U_DAC (9 pins), U_DAC_Bank_C/U_DAC (8 pins), U_DAC_Bank_C/U_DAC (8 pins), U_DAC_Bank_C/U_DAC (7 pins), U_DAC_Bank_D/U_DAC (9 pins), U_DAC_Bank_D/U_DAC (8 pins), U_DAC_Bank_D/U_DAC (8 pins), U_DAC_Bank_D/U_DAC (7 pins), Output_block (34 pins)
VDDD: Main (18 pins), U_DAC_Bank_A/U_DAC (C4_U_DAC_Bank_A_U_DAC#1.2 IC2_U_DAC_Bank_A_U_DAC#1.12), U_DAC_Bank_A/U_DAC (C4_U_DAC_Bank_A_U_DAC#2.2 IC2_U_DAC_Bank_A_U_DAC#2.12 IC2_U_DAC_Bank_A_U_DAC#2.13), U_DAC_Bank_A/U_DAC (C4_U_DAC_Bank_A_U_DAC#3.2 IC2_U_DAC_Bank_A_U_DAC#3.12 IC2_U_DAC_Bank_A_U_DAC#3.14), U_DAC_Bank_A/U_DAC (C4_U_DAC_Bank_A_U_DAC#4.2 IC2_U_DAC_Bank_A_U_DAC#4.12 IC2_U_DAC_Bank_A_U_DAC#4.13 IC2_U_DAC_Bank_A_U_DAC#4.14), U_DAC_Bank_B/U_DAC (C4_U_DAC_Bank_B_U_DAC#1.2 IC2_U_DAC_Bank_B_U_DAC#1.12), U_DAC_Bank_B/U_DAC (C4_U_DAC_Bank_B_U_DAC#2.2 IC2_U_DAC_Bank_B_U_DAC#2.12 IC2_U_DAC_Bank_B_U_DAC#2.13), U_DAC_Bank_B/U_DAC (C4_U_DAC_Bank_B_U_DAC#3.2 IC2_U_DAC_Bank_B_U_DAC#3.12 IC2_U_DAC_Bank_B_U_DAC#3.14), U_DAC_Bank_B/U_DAC (C4_U_DAC_Bank_B_U_DAC#4.2 IC2_U_DAC_Bank_B_U_DAC#4.12 IC2_U_DAC_Bank_B_U_DAC#4.13 IC2_U_DAC_Bank_B_U_DAC#4.14), U_DAC_Bank_C/U_DAC (C4_U_DAC_Bank_C_U_DAC#1.2 IC2_U_DAC_Bank_C_U_DAC#1.12), U_DAC_Bank_C/U_DAC (C4_U_DAC_Bank_C_U_DAC#2.2 IC2_U_DAC_Bank_C_U_DAC#2.12 IC2_U_DAC_Bank_C_U_DAC#2.13), U_DAC_Bank_C/U_DAC (C4_U_DAC_Bank_C_U_DAC#3.2 IC2_U_DAC_Bank_C_U_DAC#3.12 IC2_U_DAC_Bank_C_U_DAC#3.14), U_DAC_Bank_C/U_DAC (C4_U_DAC_Bank_C_U_DAC#4.2 IC2_U_DAC_Bank_C_U_DAC#4.12 IC2_U_DAC_Bank_C_U_DAC#4.13 IC2_U_DAC_Bank_C_U_DAC#4.14), U_DAC_Bank_D/U_DAC (C4_U_DAC_Bank_D_U_DAC#1.2 IC2_U_DAC_Bank_D_U_DAC#1.12), U_DAC_Bank_D/U_DAC (C4_U_DAC_Bank_D_U_DAC#2.2 IC2_U_DAC_Bank_D_U_DAC#2.12 IC2_U_DAC_Bank_D_U_DAC#2.13), U_DAC_Bank_D/U_DAC (C4_U_DAC_Bank_D_U_DAC#3.2 IC2_U_DAC_Bank_D_U_DAC#3.12 IC2_U_DAC_Bank_D_U_DAC#3.14), U_DAC_Bank_D/U_DAC (C4_U_DAC_Bank_D_U_DAC#4.2 IC2_U_DAC_Bank_D_U_DAC#4.12 IC2_U_DAC_Bank_D_U_DAC#4.13 IC2_U_DAC_Bank_D_U_DAC#4.14)
VREF: Main (L6.2 TP4.1), U_DAC_Bank_A/U_DAC (R2_U_DAC_Bank_A_U_DAC#1.1), U_DAC_Bank_A/U_DAC (R2_U_DAC_Bank_A_U_DAC#2.1), U_DAC_Bank_A/U_DAC (R2_U_DAC_Bank_A_U_DAC#3.1), U_DAC_Bank_A/U_DAC (R2_U_DAC_Bank_A_U_DAC#4.1), U_DAC_Bank_B/U_DAC (R2_U_DAC_Bank_B_U_DAC#1.1), U_DAC_Bank_B/U_DAC (R2_U_DAC_Bank_B_U_DAC#2.1), U_DAC_Bank_B/U_DAC (R2_U_DAC_Bank_B_U_DAC#3.1), U_DAC_Bank_B/U_DAC (R2_U_DAC_Bank_B_U_DAC#4.1), U_DAC_Bank_C/U_DAC (R2_U_DAC_Bank_C_U_DAC#1.1), U_DAC_Bank_C/U_DAC (R2_U_DAC_Bank_C_U_DAC#2.1), U_DAC_Bank_C/U_DAC (R2_U_DAC_Bank_C_U_DAC#3.1), U_DAC_Bank_C/U_DAC (R2_U_DAC_Bank_C_U_DAC#4.1), U_DAC_Bank_D/U_DAC (R2_U_DAC_Bank_D_U_DAC#1.1), U_DAC_Bank_D/U_DAC (R2_U_DAC_Bank_D_U_DAC#2.1), U_DAC_Bank_D/U_DAC (R2_U_DAC_Bank_D_U_DAC#3.1), U_DAC_Bank_D/U_DAC (R2_U_DAC_Bank_D_U_DAC#4.1)
VSUP: Main (L4.2 TP3.1), U_DAC_Bank_A/U_DAC (R1_U_DAC_Bank_A_U_DAC#1.1), U_DAC_Bank_A/U_DAC (R1_U_DAC_Bank_A_U_DAC#2.1), U_DAC_Bank_A/U_DAC (R1_U_DAC_Bank_A_U_DAC#3.1), U_DAC_Bank_A/U_DAC (R1_U_DAC_Bank_A_U_DAC#4.1), U_DAC_Bank_B/U_DAC (R1_U_DAC_Bank_B_U_DAC#1.1), U_DAC_Bank_B/U_DAC (R1_U_DAC_Bank_B_U_DAC#2.1), U_DAC_Bank_B/U_DAC (R1_U_DAC_Bank_B_U_DAC#3.1), U_DAC_Bank_B/U_DAC (R1_U_DAC_Bank_B_U_DAC#4.1), U_DAC_Bank_C/U_DAC (R1_U_DAC_Bank_C_U_DAC#1.1), U_DAC_Bank_C/U_DAC (R1_U_DAC_Bank_C_U_DAC#2.1), U_DAC_Bank_C/U_DAC (R1_U_DAC_Bank_C_U_DAC#3.1), U_DAC_Bank_C/U_DAC (R1_U_DAC_Bank_C_U_DAC#4.1), U_DAC_Bank_D/U_DAC (R1_U_DAC_Bank_D_U_DAC#1.1), U_DAC_Bank_D/U_DAC (R1_U_DAC_Bank_D_U_DAC#2.1), U_DAC_Bank_D/U_DAC (R1_U_DAC_Bank_D_U_DAC#3.1), U_DAC_Bank_D/U_DAC (R1_U_DAC_Bank_D_U_DAC#4.1)
HV_OFFSET_A0: U_DAC_Bank_A/U_DAC (IC1_U_DAC_Bank_A_U_DAC#1.2), Output_block (J3.a8)
HV_OFFSET_A1: U_DAC_Bank_A/U_DAC (IC1_U_DAC_Bank_A_U_DAC#1.4), Output_block (J3.c8)
HV_OFFSET_A2: U_DAC_Bank_A/U_DAC (IC1_U_DAC_Bank_A_U_DAC#1.7), Output_block (J3.a7)
HV_OFFSET_A3: U_DAC_Bank_A/U_DAC (IC1_U_DAC_Bank_A_U_DAC#1.9), Output_block (J3.c7)
HV_OFFSET_A4: U_DAC_Bank_A/U_DAC (IC1_U_DAC_Bank_A_U_DAC#2.2), Output_block (J3.a6)
HV_OFFSET_A5: U_DAC_Bank_A/U_DAC (IC1_U_DAC_Bank_A_U_DAC#2.4), Output_block (J3.c6)
HV_OFFSET_A6: U_DAC_Bank_A/U_DAC (IC1_U_DAC_Bank_A_U_DAC#2.7), Output_block (J3.a5)
HV_OFFSET_A7: U_DAC_Bank_A/U_DAC (IC1_U_DAC_Bank_A_U_DAC#2.9), Output_block (J3.c5)
HV_OFFSET_A8: U_DAC_Bank_A/U_DAC (IC1_U_DAC_Bank_A_U_DAC#3.2), Output_block (J3.a4)
HV_OFFSET_A9: U_DAC_Bank_A/U_DAC (IC1_U_DAC_Bank_A_U_DAC#3.4), Output_block (J3.c4)
HV_OFFSET_A10: U_DAC_Bank_A/U_DAC (IC1_U_DAC_Bank_A_U_DAC#3.7), Output_block (J3.a3)
HV_OFFSET_A11: U_DAC_Bank_A/U_DAC (IC1_U_DAC_Bank_A_U_DAC#3.9), Output_block (J3.c3)
HV_OFFSET_A12: U_DAC_Bank_A/U_DAC (IC1_U_DAC_Bank_A_U_DAC#4.2), Output_block (J3.a2)
HV_OFFSET_A13: U_DAC_Bank_A/U_DAC (IC1_U_DAC_Bank_A_U_DAC#4.4), Output_block (J3.c2)
HV_OFFSET_A14: U_DAC_Bank_A/U_DAC (IC1_U_DAC_Bank_A_U_DAC#4.7), Output_block (J3.a1)
HV_OFFSET_A15: U_DAC_Bank_A/U_DAC (IC1_U_DAC_Bank_A_U_DAC#4.9), Output_block (J3.c1)
HV_OFFSET_B0: U_DAC_Bank_B/U_DAC (IC1_U_DAC_Bank_B_U_DAC#1.2), Output_block (J3.a16)
HV_OFFSET_B1: U_DAC_Bank_B/U_DAC (IC1_U_DAC_Bank_B_U_DAC#1.4), Output_block (J3.c16)
HV_OFFSET_B2: U_DAC_Bank_B/U_DAC (IC1_U_DAC_Bank_B_U_DAC#1.7), Output_block (J3.a15)
HV_OFFSET_B3: U_DAC_Bank_B/U_DAC (IC1_U_DAC_Bank_B_U_DAC#1.9), Output_block (J3.c15)
HV_OFFSET_B4: U_DAC_Bank_B/U_DAC (IC1_U_DAC_Bank_B_U_DAC#2.2), Output_block (J3.a14)
HV_OFFSET_B5: U_DAC_Bank_B/U_DAC (IC1_U_DAC_Bank_B_U_DAC#2.4), Output_block (J3.c14)
HV_OFFSET_B6: U_DAC_Bank_B/U_DAC (IC1_U_DAC_Bank_B_U_DAC#2.7), Output_block (J3.a13)
HV_OFFSET_B7: U_DAC_Bank_B/U_DAC (IC1_U_DAC_Bank_B_U_DAC#2.9), Output_block (J3.c13)
HV_OFFSET_B8: U_DAC_Bank_B/U_DAC (IC1_U_DAC_Bank_B_U_DAC#3.2), Output_block (J3.a12)
HV_OFFSET_B9: U_DAC_Bank_B/U_DAC (IC1_U_DAC_Bank_B_U_DAC#3.4), Output_block (J3.c12)
HV_OFFSET_B10: U_DAC_Bank_B/U_DAC (IC1_U_DAC_Bank_B_U_DAC#3.7), Output_block (J3.a11)
HV_OFFSET_B11: U_DAC_Bank_B/U_DAC (IC1_U_DAC_Bank_B_U_DAC#3.9), Output_block (J3.c11)
HV_OFFSET_B12: U_DAC_Bank_B/U_DAC (IC1_U_DAC_Bank_B_U_DAC#4.2), Output_block (J3.a10)
HV_OFFSET_B13: U_DAC_Bank_B/U_DAC (IC1_U_DAC_Bank_B_U_DAC#4.4), Output_block (J3.c10)
HV_OFFSET_B14: U_DAC_Bank_B/U_DAC (IC1_U_DAC_Bank_B_U_DAC#4.7), Output_block (J3.a9)
HV_OFFSET_B15: U_DAC_Bank_B/U_DAC (IC1_U_DAC_Bank_B_U_DAC#4.9), Output_block (J3.c9)
HV_OFFSET_C0: U_DAC_Bank_C/U_DAC (IC1_U_DAC_Bank_C_U_DAC#1.2), Output_block (J3.c30)
HV_OFFSET_C1: U_DAC_Bank_C/U_DAC (IC1_U_DAC_Bank_C_U_DAC#1.4), Output_block (J3.c26)
HV_OFFSET_C2: U_DAC_Bank_C/U_DAC (IC1_U_DAC_Bank_C_U_DAC#1.7), Output_block (J3.c22)
HV_OFFSET_C3: U_DAC_Bank_C/U_DAC (IC1_U_DAC_Bank_C_U_DAC#1.9), Output_block (J3.c18)
HV_OFFSET_C4: U_DAC_Bank_C/U_DAC (IC1_U_DAC_Bank_C_U_DAC#2.2), Output_block (J3.a19)
HV_OFFSET_C5: U_DAC_Bank_C/U_DAC (IC1_U_DAC_Bank_C_U_DAC#2.4), Output_block (J3.a23)
HV_OFFSET_C6: U_DAC_Bank_C/U_DAC (IC1_U_DAC_Bank_C_U_DAC#2.7), Output_block (J3.a27)
HV_OFFSET_C7: U_DAC_Bank_C/U_DAC (IC1_U_DAC_Bank_C_U_DAC#2.9), Output_block (J3.a31)
HV_OFFSET_C8: U_DAC_Bank_C/U_DAC (IC1_U_DAC_Bank_C_U_DAC#3.2), Output_block (J3.a30)
HV_OFFSET_C9: U_DAC_Bank_C/U_DAC (IC1_U_DAC_Bank_C_U_DAC#3.4), Output_block (J3.a26)
HV_OFFSET_C10: U_DAC_Bank_C/U_DAC (IC1_U_DAC_Bank_C_U_DAC#3.7), Output_block (J3.a22)
HV_OFFSET_C11: U_DAC_Bank_C/U_DAC (IC1_U_DAC_Bank_C_U_DAC#3.9), Output_block (J3.a18)
HV_OFFSET_C12: U_DAC_Bank_C/U_DAC (IC1_U_DAC_Bank_C_U_DAC#4.2), Output_block (J3.c19)
HV_OFFSET_C13: U_DAC_Bank_C/U_DAC (IC1_U_DAC_Bank_C_U_DAC#4.4), Output_block (J3.c23)
HV_OFFSET_C14: U_DAC_Bank_C/U_DAC (IC1_U_DAC_Bank_C_U_DAC#4.7), Output_block (J3.c27)
HV_OFFSET_C15: U_DAC_Bank_C/U_DAC (IC1_U_DAC_Bank_C_U_DAC#4.9), Output_block (J3.c31)
HV_OFFSET_D0: U_DAC_Bank_D/U_DAC (IC1_U_DAC_Bank_D_U_DAC#1.2), Output_block (J3.c29)
HV_OFFSET_D1: U_DAC_Bank_D/U_DAC (IC1_U_DAC_Bank_D_U_DAC#1.4), Output_block (J3.c25)
HV_OFFSET_D2: U_DAC_Bank_D/U_DAC (IC1_U_DAC_Bank_D_U_DAC#1.7), Output_block (J3.c21)
HV_OFFSET_D3: U_DAC_Bank_D/U_DAC (IC1_U_DAC_Bank_D_U_DAC#1.9), Output_block (J3.c17)
HV_OFFSET_D4: U_DAC_Bank_D/U_DAC (IC1_U_DAC_Bank_D_U_DAC#2.2), Output_block (J3.a20)
HV_OFFSET_D5: U_DAC_Bank_D/U_DAC (IC1_U_DAC_Bank_D_U_DAC#2.4), Output_block (J3.a24)
HV_OFFSET_D6: U_DAC_Bank_D/U_DAC (IC1_U_DAC_Bank_D_U_DAC#2.7), Output_block (J3.a28)
HV_OFFSET_D7: U_DAC_Bank_D/U_DAC (IC1_U_DAC_Bank_D_U_DAC#2.9), Output_block (J3.a32)
HV_OFFSET_D8: U_DAC_Bank_D/U_DAC (IC1_U_DAC_Bank_D_U_DAC#3.2), Output_block (J3.a29)
HV_OFFSET_D9: U_DAC_Bank_D/U_DAC (IC1_U_DAC_Bank_D_U_DAC#3.4), Output_block (J3.a25)
HV_OFFSET_D10: U_DAC_Bank_D/U_DAC (IC1_U_DAC_Bank_D_U_DAC#3.7), Output_block (J3.a21)
HV_OFFSET_D11: U_DAC_Bank_D/U_DAC (IC1_U_DAC_Bank_D_U_DAC#3.9), Output_block (J3.a17)
HV_OFFSET_D12: U_DAC_Bank_D/U_DAC (IC1_U_DAC_Bank_D_U_DAC#4.2), Output_block (J3.c20)
HV_OFFSET_D13: U_DAC_Bank_D/U_DAC (IC1_U_DAC_Bank_D_U_DAC#4.4), Output_block (J3.c24)
HV_OFFSET_D14: U_DAC_Bank_D/U_DAC (IC1_U_DAC_Bank_D_U_DAC#4.7), Output_block (J3.c28)
HV_OFFSET_D15: U_DAC_Bank_D/U_DAC (IC1_U_DAC_Bank_D_U_DAC#4.9), Output_block (J3.c32)
NetIC2_U_DAC_Bank_A_U_DAC#1_9: Main (IC7.4 J4.3), U_DAC_Bank_A/U_DAC (IC2_U_DAC_Bank_A_U_DAC#1.9), U_DAC_Bank_A/U_DAC (IC2_U_DAC_Bank_A_U_DAC#2.9), U_DAC_Bank_A/U_DAC (IC2_U_DAC_Bank_A_U_DAC#3.9), U_DAC_Bank_A/U_DAC (IC2_U_DAC_Bank_A_U_DAC#4.9), U_DAC_Bank_B/U_DAC (IC2_U_DAC_Bank_B_U_DAC#1.9), U_DAC_Bank_B/U_DAC (IC2_U_DAC_Bank_B_U_DAC#2.9), U_DAC_Bank_B/U_DAC (IC2_U_DAC_Bank_B_U_DAC#3.9), U_DAC_Bank_B/U_DAC (IC2_U_DAC_Bank_B_U_DAC#4.9), U_DAC_Bank_C/U_DAC (IC2_U_DAC_Bank_C_U_DAC#1.9), U_DAC_Bank_C/U_DAC (IC2_U_DAC_Bank_C_U_DAC#2.9), U_DAC_Bank_C/U_DAC (IC2_U_DAC_Bank_C_U_DAC#3.9), U_DAC_Bank_C/U_DAC (IC2_U_DAC_Bank_C_U_DAC#4.9), U_DAC_Bank_D/U_DAC (IC2_U_DAC_Bank_D_U_DAC#1.9), U_DAC_Bank_D/U_DAC (IC2_U_DAC_Bank_D_U_DAC#2.9), U_DAC_Bank_D/U_DAC (IC2_U_DAC_Bank_D_U_DAC#3.9), U_DAC_Bank_D/U_DAC (IC2_U_DAC_Bank_D_U_DAC#4.9)
NetIC2_U_DAC_Bank_A_U_DAC#1_10: Main (IC8.4 J4.4), U_DAC_Bank_A/U_DAC (IC2_U_DAC_Bank_A_U_DAC#1.10), U_DAC_Bank_A/U_DAC (IC2_U_DAC_Bank_A_U_DAC#2.10), U_DAC_Bank_A/U_DAC (IC2_U_DAC_Bank_A_U_DAC#3.10), U_DAC_Bank_A/U_DAC (IC2_U_DAC_Bank_A_U_DAC#4.10), U_DAC_Bank_B/U_DAC (IC2_U_DAC_Bank_B_U_DAC#1.10), U_DAC_Bank_B/U_DAC (IC2_U_DAC_Bank_B_U_DAC#2.10), U_DAC_Bank_B/U_DAC (IC2_U_DAC_Bank_B_U_DAC#3.10), U_DAC_Bank_B/U_DAC (IC2_U_DAC_Bank_B_U_DAC#4.10), U_DAC_Bank_C/U_DAC (IC2_U_DAC_Bank_C_U_DAC#1.10), U_DAC_Bank_C/U_DAC (IC2_U_DAC_Bank_C_U_DAC#2.10), U_DAC_Bank_C/U_DAC (IC2_U_DAC_Bank_C_U_DAC#3.10), U_DAC_Bank_C/U_DAC (IC2_U_DAC_Bank_C_U_DAC#4.10), U_DAC_Bank_D/U_DAC (IC2_U_DAC_Bank_D_U_DAC#1.10), U_DAC_Bank_D/U_DAC (IC2_U_DAC_Bank_D_U_DAC#2.10), U_DAC_Bank_D/U_DAC (IC2_U_DAC_Bank_D_U_DAC#3.10), U_DAC_Bank_D/U_DAC (IC2_U_DAC_Bank_D_U_DAC#4.10)
NetIC2_U_DAC_Bank_A_U_DAC#1_11: Main (IC9.4 J4.5), U_DAC_Bank_A/U_DAC (IC2_U_DAC_Bank_A_U_DAC#1.11), U_DAC_Bank_A/U_DAC (IC2_U_DAC_Bank_A_U_DAC#2.11), U_DAC_Bank_A/U_DAC (IC2_U_DAC_Bank_A_U_DAC#3.11), U_DAC_Bank_A/U_DAC (IC2_U_DAC_Bank_A_U_DAC#4.11), U_DAC_Bank_B/U_DAC (IC2_U_DAC_Bank_B_U_DAC#1.11), U_DAC_Bank_B/U_DAC (IC2_U_DAC_Bank_B_U_DAC#2.11), U_DAC_Bank_B/U_DAC (IC2_U_DAC_Bank_B_U_DAC#3.11), U_DAC_Bank_B/U_DAC (IC2_U_DAC_Bank_B_U_DAC#4.11), U_DAC_Bank_C/U_DAC (IC2_U_DAC_Bank_C_U_DAC#1.11), U_DAC_Bank_C/U_DAC (IC2_U_DAC_Bank_C_U_DAC#2.11), U_DAC_Bank_C/U_DAC (IC2_U_DAC_Bank_C_U_DAC#3.11), U_DAC_Bank_C/U_DAC (IC2_U_DAC_Bank_C_U_DAC#4.11), U_DAC_Bank_D/U_DAC (IC2_U_DAC_Bank_D_U_DAC#1.11), U_DAC_Bank_D/U_DAC (IC2_U_DAC_Bank_D_U_DAC#2.11), U_DAC_Bank_D/U_DAC (IC2_U_DAC_Bank_D_U_DAC#3.11), U_DAC_Bank_D/U_DAC (IC2_U_DAC_Bank_D_U_DAC#4.11)
NetIC2_U_DAC_Bank_A_U_DAC#1_15: Main (IC3.4 LD2.2), U_DAC_Bank_A/U_DAC (IC2_U_DAC_Bank_A_U_DAC#1.15), U_DAC_Bank_A/U_DAC (IC2_U_DAC_Bank_A_U_DAC#2.15), U_DAC_Bank_A/U_DAC (IC2_U_DAC_Bank_A_U_DAC#3.15), U_DAC_Bank_A/U_DAC (IC2_U_DAC_Bank_A_U_DAC#4.15)
NetIC2_U_DAC_Bank_B_U_DAC#1_15: Main (IC3.5 LD3.2), U_DAC_Bank_B/U_DAC (IC2_U_DAC_Bank_B_U_DAC#1.15), U_DAC_Bank_B/U_DAC (IC2_U_DAC_Bank_B_U_DAC#2.15), U_DAC_Bank_B/U_DAC (IC2_U_DAC_Bank_B_U_DAC#3.15), U_DAC_Bank_B/U_DAC (IC2_U_DAC_Bank_B_U_DAC#4.15)
NetIC2_U_DAC_Bank_C_U_DAC#1_15: Main (IC3.6 LD4.2), U_DAC_Bank_C/U_DAC (IC2_U_DAC_Bank_C_U_DAC#1.15), U_DAC_Bank_C/U_DAC (IC2_U_DAC_Bank_C_U_DAC#2.15), U_DAC_Bank_C/U_DAC (IC2_U_DAC_Bank_C_U_DAC#3.15), U_DAC_Bank_C/U_DAC (IC2_U_DAC_Bank_C_U_DAC#4.15)
NetIC2_U_DAC_Bank_D_U_DAC#1_15: Main (IC3.7 LD5.2), U_DAC_Bank_D/U_DAC (IC2_U_DAC_Bank_D_U_DAC#1.15), U_DAC_Bank_D/U_DAC (IC2_U_DAC_Bank_D_U_DAC#2.15), U_DAC_Bank_D/U_DAC (IC2_U_DAC_Bank_D_U_DAC#3.15), U_DAC_Bank_D/U_DAC (IC2_U_DAC_Bank_D_U_DAC#4.15)